# EAGLE design JST_CONNECTOR_v4 (EAGLE 9.7.0)
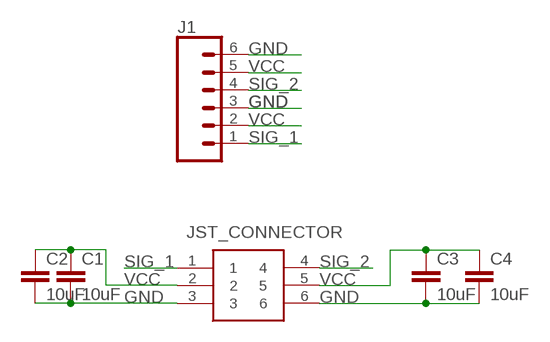
[diagram p0: schematic, sheet 1]

## Parts
C1  10uF  10UF-0805-10V-10%  [0805]
C2  10uF  10UF-0805-10V-10%  [0805]
C3  10uF  10UF-0805-10V-10%  [0805]
C4  10uF  10UF-0805-10V-10%  [0805]
J1  CONN_06SILK_FEMALE_PTH  [1X06]
JST_CONNECTOR  0532610671  [0532610671]

## Nets
GND: C1.2 C2.2 C3.2 C4.2 J1.3 J1.6 JST_CONNECTOR.3 JST_CONNECTOR.6
SIG_1: J1.1 JST_CONNECTOR.1
SIG_2: J1.4 JST_CONNECTOR.4
VCC: C1.1 C2.1 C3.1 C4.1 J1.2 J1.5 JST_CONNECTOR.2 JST_CONNECTOR.5

## Library data of the parts
C1-C4 = SparkFun-Capacitors:10UF: 10.0µF ceramic capacitors A capacitor is a passive two-terminal electrical component used to store electrical energy temporarily in an electric field.; PROD_ID: CAP-11330
J1 = SparkFun-Connectors:CONN_06: Multi connection point. Often used as Generic Header-pin footprint for 0.1 inch spaced/style header connections On any of the 0.1 inch spaced packages, you can populate with these: Break Away Headers - Straight <https://www.sparkfun.com/products/116> (PRT-00116) Break Away Male Headers - Right Angle <https://www.sparkfun.com/products/553> (PRT-00553) Female Headers <https://www.sparkfun.com/products/115> (PRT-00115) Break Away Headers - Machine Pin <https://www.sparkfun.com/products/117> (PRT-00117) Break Away Female Headers - Swiss Machine Pin <https://www.sparkfun.com/products/743> (PRT-00743) Arduino Stackable Header - 6 Pin <https://www.sparkfun.com/products/9280> (PRT-09280) For SCREWTERMINALS and SPRING TERMINALS visit here: Screw Terimnals on SparkFun.com <https://www.sparkfun.com/search/results?term=Screw+Terminals> (5mm/3.5mm/2.54mm spacing) This device is also useful as a general connection point to wire up your design to another part of your project. Our various solder wires solder well into these plated through hole pads. Hook-Up Wire - Assortment (Stranded, 22 AWG) <https://www.sparkfun.com/products/11375> (PRT-11375) Hook-Up Wire - Assortment (Solid Core, 22 AWG) <https://www.sparkfun.com/products/11367> (PRT-11367) View the entire wire category on our website here <https://www.sparkfun.com/categories/141>; PROD_ID: CONN-08437
JST_CONNECTOR = 0532610671:0532610671: 1.25mm Pitch PicoBlade Header, Surface Mount, Right Angle, 6 Circuits Source: Datasheet <http://www.molex.com/webdocs/datasheets/pdf/en-us//0532610671_PCB_HEADERS.pdf>; ARROW_PART_NUMBER: 0532610671; ARROW_PRICE-STOCK: https://www.arrow.com/en/products/0532610671/molex?region=europe; DESCRIPTION: 1.25mm Pitch PicoBlade Header, Surface Mount, Right Angle, 6 Circuits; HEIGHT: mm; MANUFACTURER_NAME: Molex; MANUFACTURER_PART_NUMBER: 0532610671; MOUSER_PART_NUMBER: N/A; MOUSER_PRICE-STOCK: https://www.mouser.co.uk/ProductDetail/Molex/0532610671?qs=PBcRNPEHKspfA5Wux0sJoA%3D%3D

## Board
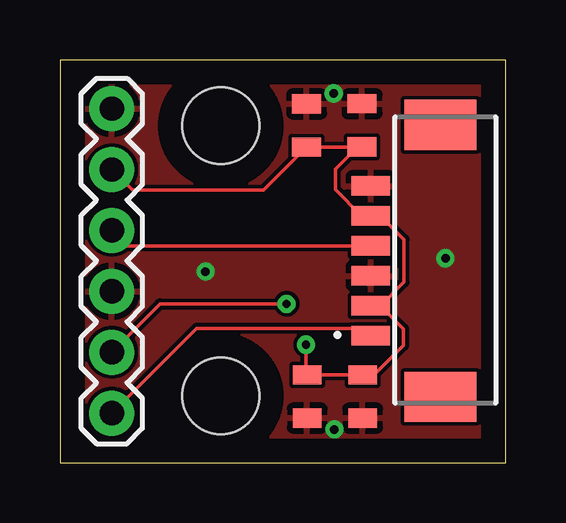
[diagram p1: board, top side]
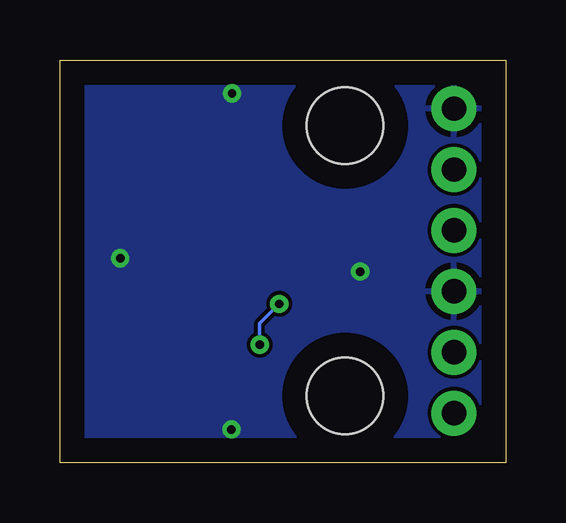
[diagram p2: board, bottom side, seen from below]

Size 18.59 x 16.8 mm. Coordinates in mm from the lower left corner, seen from the top.
Outline: 0,0 18.59,0 18.59,16.8 0,16.8 0,0
Copper layers (1*16): Top 0.035mm / dielectric 1.5mm / Bottom 0.035mm
Design rules "default": minimum track width 6mil, minimum drill 0.35mm, track to track 6mil, track to pad 6mil, pad to pad 6mil, via to via 6mil, smd to smd 6mil, copper to edge 40mil, drill to drill 6mil, minimum pad ring 10mil, minimum via ring 8mil, stop-mask expansion 4mil, vias tented up to drill 0mil, thermal gap 10mil
Holes 3.2 mm at 6.71,14.06 6.71,2.79

### Footprints (pad centres in the part's own frame; a part is rotated, then mirrored left to right if it is on the bottom)
0805 = smd 0.8 x 1.2: 1 -0.9,0; 2 0.9,0
1X06 = drill 1.016 pad 1.88: 1 0,0; 2 2.54,0; 3 5.08,0; 4 7.62,0; 5 10.16,0; 6 12.7,0
0532610671 = smd 0.8 x 1.6: 1 -3.125,1.004; 2 -1.875,1.004; 3 -0.625,1.004; 4 0.625,1.004; 5 1.875,1.004; 6 3.125,1.004 | smd 2.1 x 3: 7 -5.675,-1.896; 8 5.675,-1.896

### Placement (x,y rotation side)
C1  12.62,2.77 270 top
C2  10.29,14.07 90 top
C3  12.6,14.08 90 top
C4  10.31,2.77 270 top
J1  2.16,2.07 90 top
JST_CONNECTOR  13.97,8.43 90 top

### Tracks (layer width: path | path; a pad name or v marks a point on that pad's centre or on a via)
GND  (via drill 0.35)
  other vias: 11.42,15.41 11.44,1.39 16.08,8.53 6.07,7.98
  pour Top: 0.2,0.13 18.47,0.13 18.47,16.61 0.2,16.61
  pour Bottom: 0.2,0.13 18.47,0.13 18.47,16.61 0.2,16.61
SIG_1
  Top 0.152: JST_CONNECTOR.1 12.66,5.61 5.7,5.61 J1.1
SIG_2
  Top 0.152: JST_CONNECTOR.4 2.8,9.05 J1.4
VCC  (via drill 0.35)
  Top 0.152: 13.37,6.55 14.32,5.59 14.32,4.9 13.1,3.67 C1.1 C4.1 10.26,3.72 v10.26,4.93 | 13.37,6.55 14.35,7.54 14.35,9.32 13.37,10.3 JST_CONNECTOR.5 12.57,10.3 11.48,11.39 11.48,12.26 12.4,13.18 C3.1 C2.1 8.48,11.37 3.02,11.37 J1.5 | 13.37,6.55 JST_CONNECTOR.2 | J1.2 4.18,6.63 v9.45,6.63
  Bottom 0.152: v9.45,6.63 10.26,5.82 v10.26,4.93